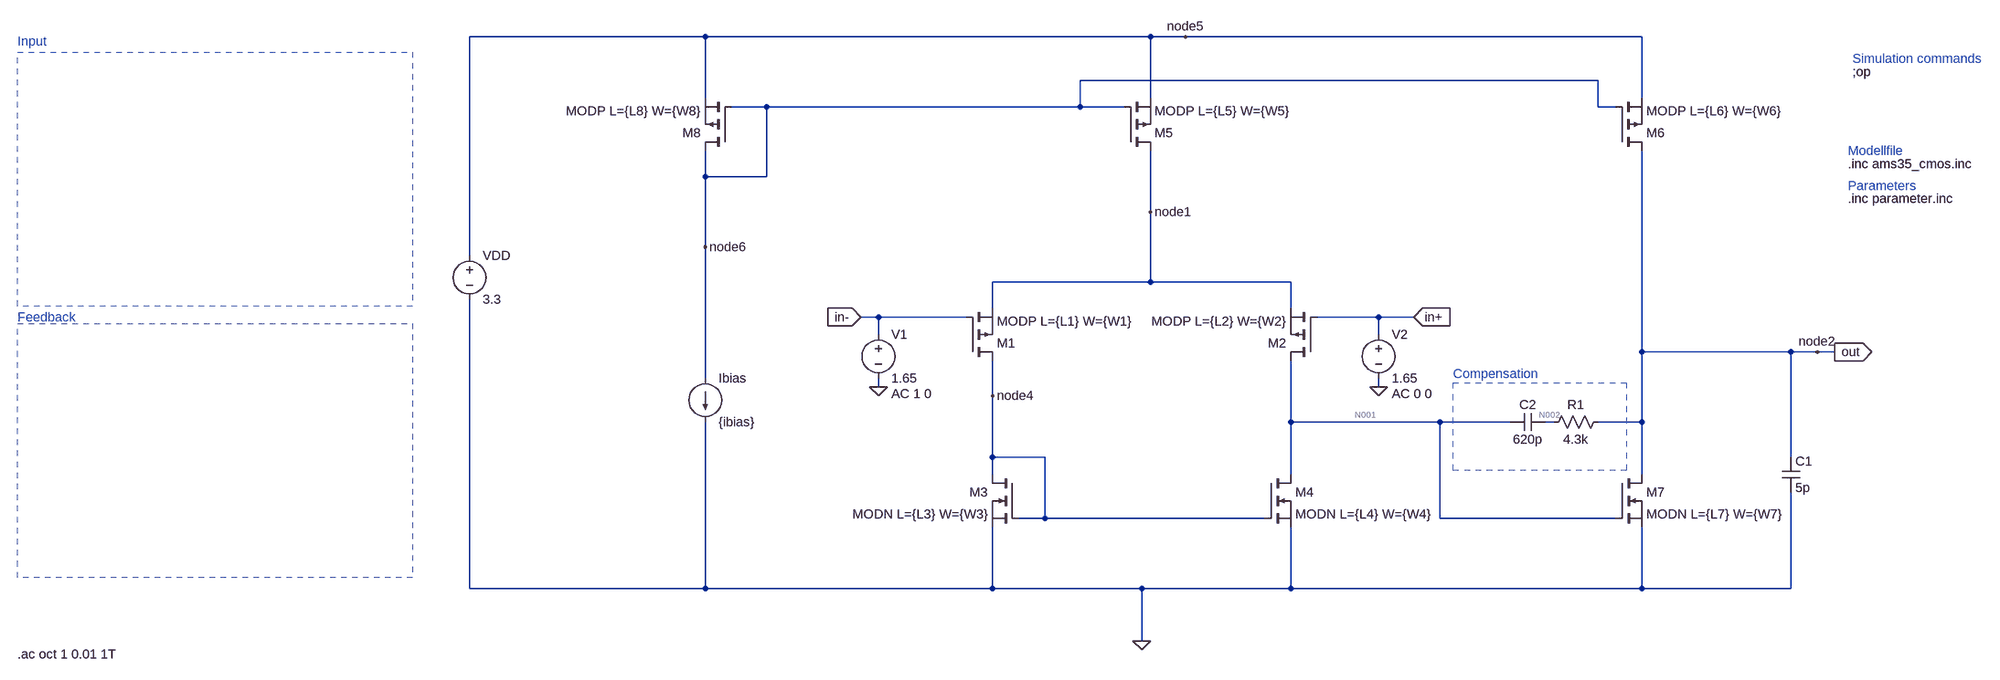
[diagram p0: schematic miller_ota.asc]
miller_ota.asc, the LTspice schematic file:
Version 4
SHEET 1 4076 2488
WIRE 1296 816 816 816
WIRE 2176 816 1296 816
WIRE 2240 816 2176 816
WIRE 3072 816 2240 816
WIRE 2992 896 2048 896
WIRE 1296 928 1296 816
WIRE 2176 928 2176 816
WIRE 3072 928 3072 816
WIRE 1408 944 1344 944
WIRE 2048 944 2048 896
WIRE 2048 944 1408 944
WIRE 2128 944 2048 944
WIRE 2992 944 2992 896
WIRE 3024 944 2992 944
WIRE 1296 1072 1296 1024
WIRE 1408 1072 1408 944
WIRE 1408 1072 1296 1072
WIRE 2176 1136 2176 1024
WIRE 1296 1200 1296 1072
WIRE 816 1216 816 816
WIRE 2176 1264 2176 1136
WIRE 2176 1264 1888 1264
WIRE 2432 1264 2176 1264
WIRE 1888 1312 1888 1264
WIRE 2432 1312 2432 1264
WIRE 1680 1328 1648 1328
WIRE 1840 1328 1680 1328
WIRE 2592 1328 2480 1328
WIRE 2656 1328 2592 1328
WIRE 1680 1360 1680 1328
WIRE 2592 1360 2592 1328
WIRE 3072 1392 3072 1024
WIRE 3232 1392 3072 1392
WIRE 3344 1392 3232 1392
WIRE 3392 1392 3344 1392
WIRE 3424 1392 3392 1392
WIRE 1296 1440 1296 1200
WIRE 1680 1456 1680 1440
WIRE 2432 1456 2432 1408
WIRE 2592 1456 2592 1440
WIRE 1888 1472 1888 1408
WIRE 2432 1520 2432 1456
WIRE 2704 1520 2432 1520
WIRE 2832 1520 2704 1520
WIRE 2912 1520 2896 1520
WIRE 3072 1520 3072 1392
WIRE 3072 1520 2992 1520
WIRE 1888 1584 1888 1472
WIRE 1984 1584 1888 1584
WIRE 3344 1584 3344 1392
WIRE 1888 1616 1888 1584
WIRE 2432 1616 2432 1520
WIRE 3072 1616 3072 1520
WIRE 1984 1696 1984 1584
WIRE 1984 1696 1936 1696
WIRE 2384 1696 1984 1696
WIRE 2704 1696 2704 1520
WIRE 2800 1696 2704 1696
WIRE 3024 1696 2800 1696
WIRE 816 1824 816 1296
WIRE 1296 1824 1296 1520
WIRE 1296 1824 816 1824
WIRE 1888 1824 1888 1712
WIRE 1888 1824 1296 1824
WIRE 2160 1824 1888 1824
WIRE 2432 1824 2432 1712
WIRE 2432 1824 2160 1824
WIRE 3072 1824 3072 1712
WIRE 3072 1824 2432 1824
WIRE 3344 1824 3344 1648
WIRE 3344 1824 3072 1824
WIRE 2160 1920 2160 1824
FLAG 3424 1392 out
IOPIN 3424 1392 Out
FLAG 2656 1328 in+
IOPIN 2656 1328 In
FLAG 1648 1328 in-
IOPIN 1648 1328 In
FLAG 2160 1920 0
FLAG 1680 1456 0
FLAG 2592 1456 0
FLAG 2176 1136 node1
FLAG 1888 1472 node4
FLAG 2240 816 node5
FLAG 1296 1200 node6
FLAG 3392 1392 node2
DATAFLAG 3232 1392 ""
DATAFLAG 2800 1696 ""
DATAFLAG 2432 1456 ""
DATAFLAG 2176 1136 ""
SYMBOL pmos 1840 1408 M180
SYMATTR InstName M1
SYMATTR Value MODP L={L1} W={W1}
SYMBOL pmos 2480 1408 R180
SYMATTR InstName M2
SYMATTR Value MODP L={L2} W={W2}
SYMBOL pmos 2128 1024 M180
SYMATTR InstName M5
SYMATTR Value MODP L={L5} W={W5}
SYMBOL nmos 2384 1616 R0
SYMATTR InstName M4
SYMATTR Value MODN L={L4} W={W4}
SYMBOL nmos 1936 1616 M0
SYMATTR InstName M3
SYMATTR Value MODN L={L3} W={W3}
SYMBOL voltage 816 1200 R0
WINDOW 123 0 0 Left 2
WINDOW 39 0 0 Left 2
SYMATTR InstName VDD
SYMATTR Value 3.3
SYMBOL nmos 3024 1616 R0
SYMATTR InstName M7
SYMATTR Value MODN L={L7} W={W7}
SYMBOL pmos 3024 1024 M180
SYMATTR InstName M6
SYMATTR Value MODP L={L6} W={W6}
SYMBOL pmos 1344 1024 R180
SYMATTR InstName M8
SYMATTR Value MODP L={L8} W={W8}
SYMBOL current 1296 1440 R0
WINDOW 123 0 0 Left 2
WINDOW 39 0 0 Left 2
SYMATTR InstName Ibias
SYMATTR Value {ibias}
SYMBOL cap 3328 1584 R0
SYMATTR InstName C1
SYMATTR Value 5p
SYMBOL voltage 1680 1344 R0
WINDOW 123 24 124 Left 2
WINDOW 39 0 0 Left 2
SYMATTR Value2 AC 1 0
SYMATTR InstName V1
SYMATTR Value 1.65
SYMBOL voltage 2592 1344 R0
WINDOW 123 24 124 Left 2
WINDOW 39 0 0 Left 2
SYMATTR Value2 AC 0 0
SYMATTR InstName V2
SYMATTR Value 1.65
SYMBOL cap 2896 1504 R90
WINDOW 0 0 32 VBottom 2
WINDOW 3 32 32 VTop 2
SYMATTR InstName C2
SYMATTR Value 620p
SYMBOL res 3008 1504 R90
WINDOW 0 0 56 VBottom 2
WINDOW 3 32 56 VTop 2
SYMATTR InstName R1
SYMATTR Value 4.3k
TEXT 3448 1048 Left 2 !.inc ams35_cmos.inc
TEXT -8 824 Left 2 ;Input
TEXT -8 1328 Left 2 ;Feedback
TEXT 3456 856 Left 2 ;Simulation commands
TEXT 3456 880 Left 2 !;op
TEXT 3448 1088 Left 2 ;Parameters
TEXT 3448 1112 Left 2 !.inc parameter.inc
TEXT 3448 1024 Left 2 ;Modellfile
TEXT 2728 1432 Left 2 ;Compensation
TEXT -8 1944 Left 2 !.ac oct 1 0.01 1T
RECTANGLE Normal -8 844 712 1308 2
RECTANGLE Normal -8 1340 712 1804 2
RECTANGLE Normal 2728 1448 3044 1608 2

The netlist it stands for:
* miller_ota.asc
M1 node4 in- node1 node1 MODP L={L1} W={W1}
M2 N001 in+ node1 node1 MODP L={L2} W={W2}
M5 node1 node6 node5 node5 MODP L={L5} W={W5}
M4 N001 node4 0 0 MODN L={L4} W={W4}
M3 node4 node4 0 0 MODN L={L3} W={W3}
VDD node5 0 3.3
M7 node2 N001 0 0 MODN L={L7} W={W7}
M6 node2 node6 node5 node5 MODP L={L6} W={W6}
M8 node6 node6 node5 node5 MODP L={L8} W={W8}
Ibias node6 0 {ibias}
C1 node2 0 5p
V1 in- 0 1.65 AC 1 0
V2 in+ 0 1.65 AC 0 0
C2 N002 N001 620p
R1 node2 N002 4.3k
.model NMOS NMOS
.model PMOS PMOS
.lib standard.mos
.inc ams35_cmos.inc
* Input
* Feedback
* Simulation commands
;op
* Parameters
.inc parameter.inc
* Modellfile
* Compensation
.ac oct 1 0.01 1T
.backanno
.end

* Results of the author's LTspice run, read from the files saved beside the schematic
* Operating Point, zero values left out:
*   V(node4) = 716.7 mV
*   V(in-) = 1.65 V
*   V(node1) = 2.386 V
*   V(n001) = 716.7 mV
*   V(in+) = 1.65 V
*   V(node6) = 2.358 V
*   V(node5) = 3.3 V
*   V(node2) = 1.51 V
*   V(n002) = 1.51 V
*   Id(M7) = 45.35 µA
*   Ib(M7) = -92.86 pA
*   Is(M7) = -45.35 µA
*   Id(M3) = 21.97 µA
*   Is(M3) = -21.97 µA
*   Id(M4) = 21.97 µA
*   Is(M4) = -21.97 µA
*   Id(M8) = -44 µA
*   Is(M8) = 44 µA
*   Id(M6) = -45.35 µA
*   Ib(M6) = 1.901 pA
*   Is(M6) = 45.35 µA
*   Id(M5) = -43.94 µA
*   Is(M5) = 43.94 µA
*   Id(M2) = -21.97 µA
*   Ib(M2) = 1.751 pA
*   Is(M2) = 21.97 µA
*   Id(M1) = -21.97 µA
*   Ib(M1) = 1.751 pA
*   Is(M1) = 21.97 µA
*   I(Ibias) = 44 µA
*   I(Vdd) = -133.3 µA
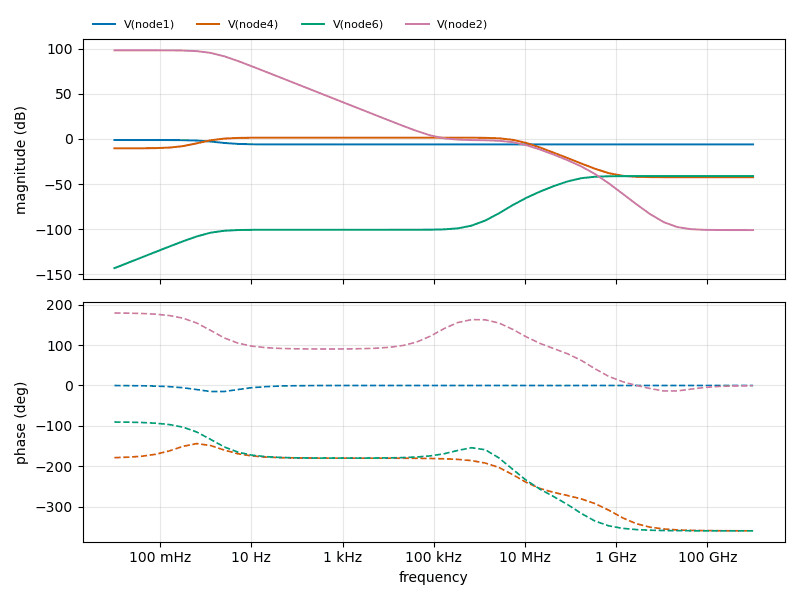
[diagram p1: AC Analysis of miller_ota.asc, plotted from the saved traces]
* AC Analysis, 1 run:
*   V(node1): -1.22 dB at 10 mHz, -6.07 dB at 1 THz, peak -1.22 dB at 10 mHz, 3 dB below the peak at 2.313 Hz
*   V(node4): -10.38 dB at 10 mHz, -42.47 dB at 1 THz, peak 1.40 dB at 2.621 kHz, 3 dB below the peak at 1.26 Hz and 6.118 MHz
*   V(node6): -143.39 dB at 10 mHz, -41.26 dB at 1 THz, peak -41.26 dB at 1 THz, 3 dB below the peak at 149.1 MHz
*   V(node2): 98.32 dB at 10 mHz, -101.11 dB at 1 THz, peak 98.32 dB at 10 mHz, 3 dB below the peak at 1.333 Hz